# EAGLE design ASD2113 (EAGLE 6.3)
DATABASE: ./../../../../../Components/TinyCircuits_Part_Database.txt
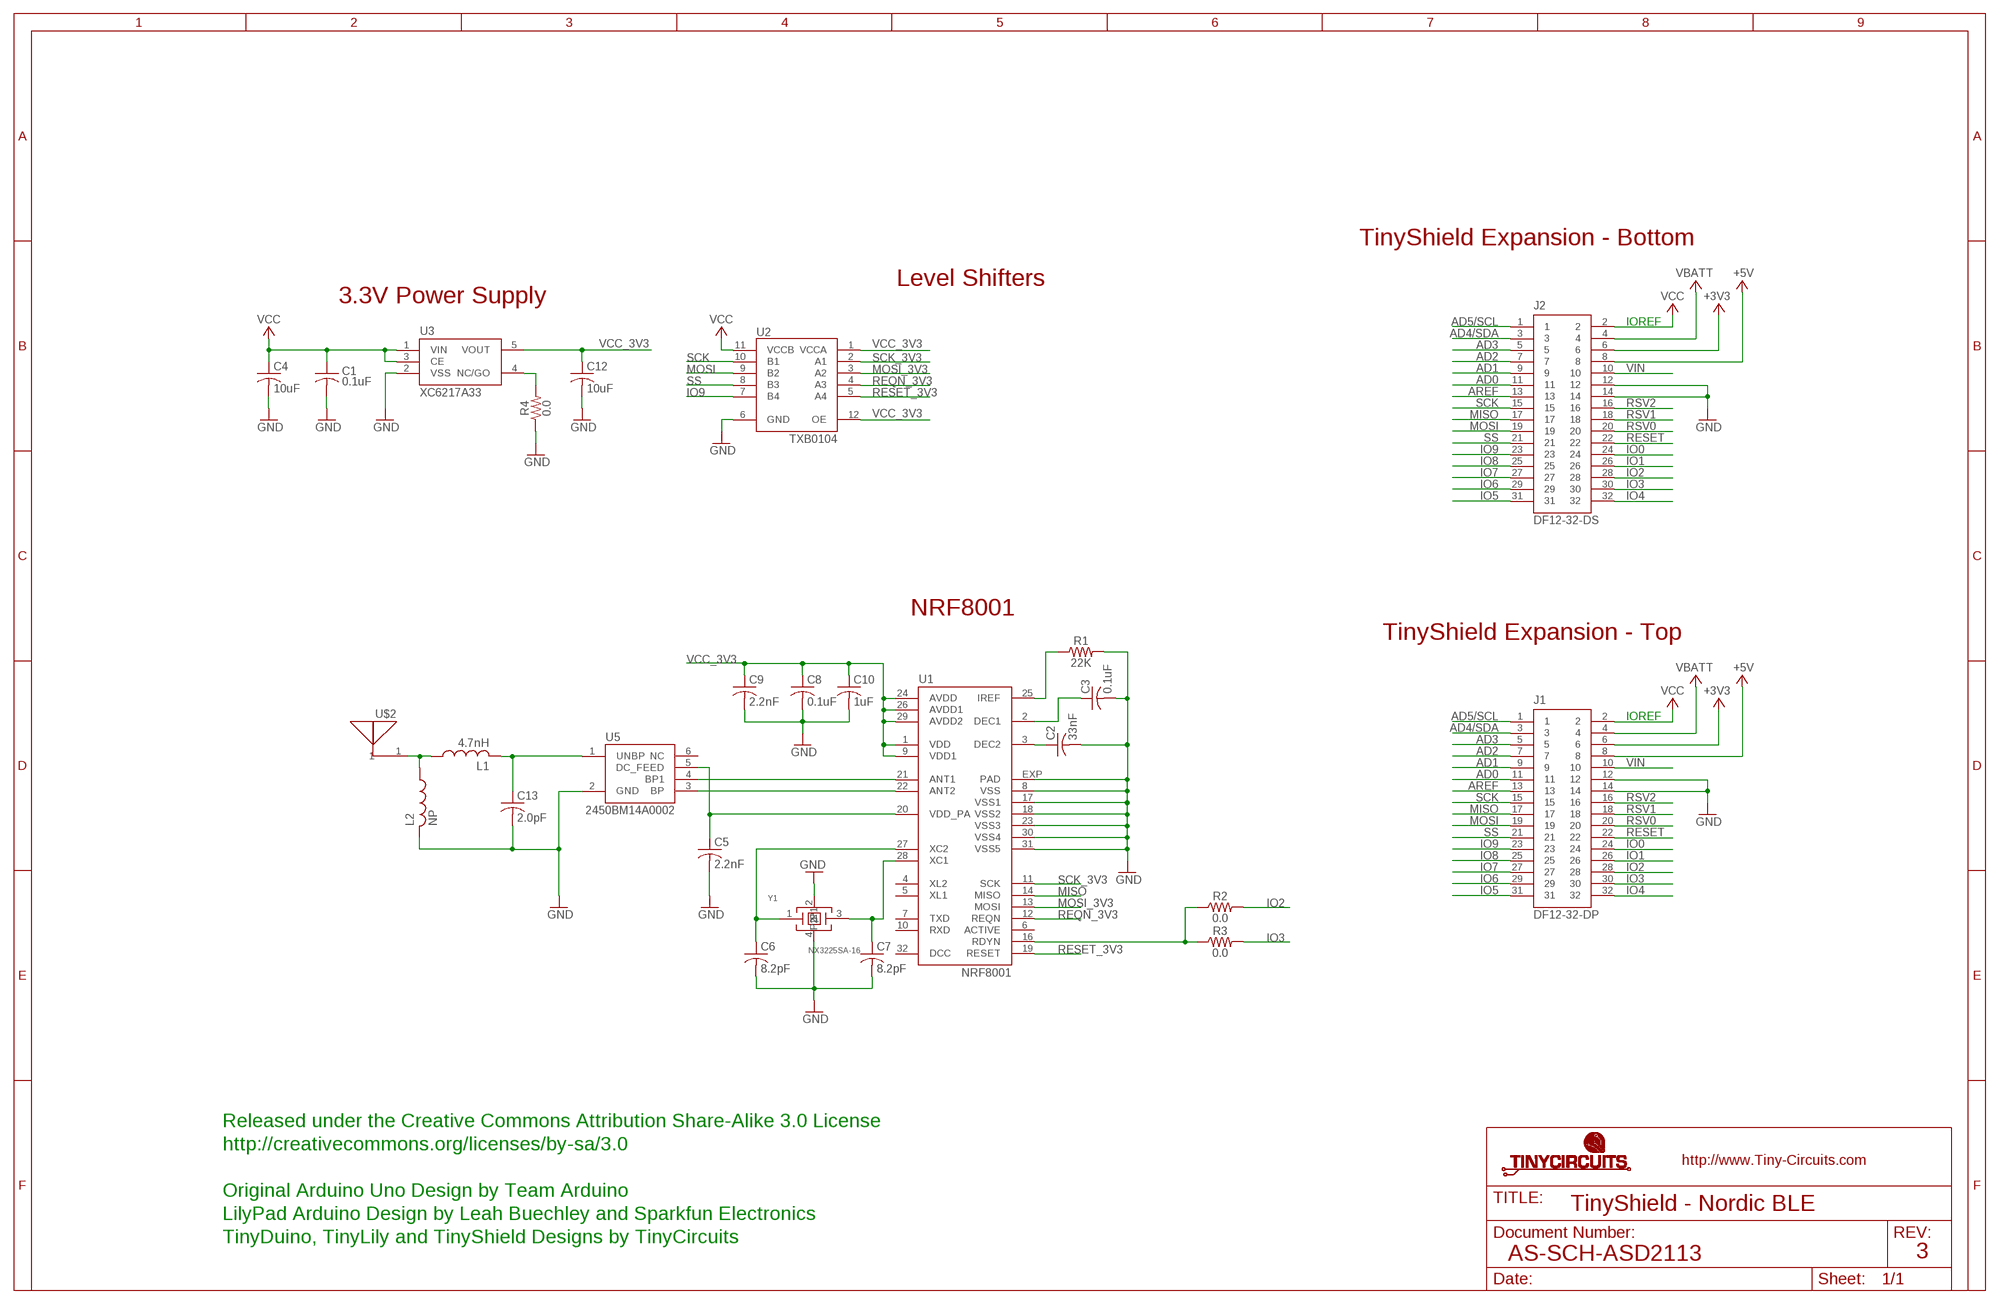
[diagram p0: schematic, sheet 1]

## Parts
C1  0.1uF  AS-ITM-00008  [C0402]
C2  33nF  AS-ITM-00248  [C0402]
C3  0.1uF  AS-ITM-00008  [C0402]
C4  10uF  AS-ITM-00045  [C0805]
C5  2.2nF  AS-ITM-00085  [C0402]
C6  8.2pF  AS-ITM-00247  [C0402]
C7  8.2pF  AS-ITM-00247  [C0402]
C8  0.1uF  AS-ITM-00008  [C0402]
C9  2.2nF  AS-ITM-00085  [C0402]
C10  1uF  AS-ITM-00105  [C0402]
C12  10uF  AS-ITM-00045  [C0805]
C13  2.0pF  AS-ITM-00245  [C0402]
J1  DF12-32-DP  AS-ITM-00015  [DF12-32-DP]
J2  DF12-32-DS  AS-ITM-00012  [DF12-32-DS]
L1  4.7nH  AS-ITM-00246  [C0402]
L2  NP  AS-ITM-00108  [C0402]
R1  22K  AS-ITM-00147  [0402]
R2  0.0  AS-ITM-00076  [0402]
R3  0.0  AS-ITM-00076  [0402]
R4  0.0  AS-ITM-00076  [0402]
U1  NRF8001  AS-ITM-00227  [ATMEL_QFN32]
U2  TXB0104  AS-ITM-00048  [UQFN-12]
U3  XC6217A33  AS-ITM-00249  [SOT-25]
U5  2450BM14A0002  AS-ITM-00114  [2450BM14A0002]
U$2  AS-ITM-00132  [2450AT18A100]
Y1  NX3225SA-16  AS-ITM-00228  [ABM11]

## Nets
+3V3: J1.6 J2.6
+5V: J1.8 J2.8
AD0: J1.11 J2.11
AD1: J1.9 J2.9
AD2: J1.7 J2.7
AD3: J1.5 J2.5
AD4/SDA: J1.3 J2.3
AD5/SCL: J1.1 J2.1
AREF: J1.13 J2.13
GND: C1.2 C2.2 C3.2 C4.2 C5.2 C6.2 C7.2 C8.2 C9.2 C10.2 C12.2 C13.2 J1.12 J1.14 J2.12 J2.14 L2.2 R1.2 R4.1 U1.8(VSS) U1.17(VSS1) U1.18(VSS2) U1.23(VSS3) U1.30(VSS4) U1.31(VSS5) U1.EXP(PAD) U2.6(GND) U3.2(VSS) U5.2(GND) Y1.2 Y1.4(P1)
IO0: J1.24 J2.24
IO1: J1.26 J2.26
IO2: J1.28 J2.28 R2.2
IO3: J1.30 J2.30 R3.2
IO4: J1.32 J2.32
IO5: J1.31 J2.31
IO6: J1.29 J2.29
IO7: J1.27 J2.27
IO8: J1.25 J2.25
IO9: J1.23 J2.23 U2.7(B4)
MISO: J1.17 J2.17 U1.14(MISO)
MOSI: J1.19 J2.19 U2.9(B2)
MOSI_3V3: U1.13(MOSI) U2.3(A2)
N$1: R1.1 U1.25(IREF)
N$2: C6.1 U1.27(XC2) Y1.1
N$3: C13.1 L1.2 U5.1(UNBP)
N$4: C3.1 U1.2(DEC1)
N$5: C2.1 U1.3(DEC2)
N$6: U1.22(ANT2) U5.3(BP)
N$7: U1.21(ANT1) U5.4(BP1)
N$8: C5.1 U1.20(VDD_PA) U5.5(DC_FEED)
N$9: C7.1 U1.28(XC1) Y1.3
N$10: L1.1 L2.1 U$2.1
N$11: R4.2 U3.4(NC/GO)
RDYN: R2.1 R3.1 U1.16(RDYN)
REQN_3V3: U1.12(REQN) U2.4(A3)
RESET: J1.22 J2.22
RESET_3V3: U1.19(RESET) U2.5(A4)
RSV0: J1.20 J2.20
RSV1: J1.18 J2.18
RSV2: J1.16 J2.16
SCK: J1.15 J2.15 U2.10(B1)
SCK_3V3: U1.11(SCK) U2.2(A1)
SS: J1.21 J2.21 U2.8(B3)
VBATT: J1.4 J2.4
VCC: C1.1 C4.1 J1.2 J2.2 U2.11(VCCB) U3.1(VIN) U3.3(CE)
VCC_3V3: C8.1 C9.1 C10.1 C12.1 U1.1(VDD) U1.9(VDD1) U1.24(AVDD) U1.26(AVDD1) U1.29(AVDD2) U2.1(VCCA) U2.12(OE) U3.5(VOUT)
VIN: J1.10 J2.10
Unconnected: U1.4(XL2) U1.5(XL1) U1.6(ACTIVE) U1.7(TXD) U1.10(RXD) U1.32(DCC) U5.6(NC) U$2.2

## Notes on the sheet
- TinyShield Expansion - Bottom
- Level Shifters
- 3.3V Power Supply
- IOREF
- NRF8001
- TinyShield Expansion - Top
- IOREF
- Released under the Creative Commons Attribution Share-Alike 3.0 License
- http://creativecommons.org/licenses/by-sa/3.0
- Original Arduino Uno Design by Team Arduino
- TinyShield - Nordic BLE
- LilyPad Arduino Design by Leah Buechley and Sparkfun Electronics
- TinyDuino, TinyLily and TinyShield Designs by TinyCircuits
- AS-SCH-ASD2113 | 3

## Library data of the parts
C1 C3 C8 = tinycircuits:AS-ITM-00008: CAP CER 0.1UF 16V 10% X5R 0402; PARTNO: AS-ITM-00008
C2 = tinycircuits:AS-ITM-00248: CAP CER 0.033UF 16V Y5V 0402; PARTNO: AS-ITM-00248
C4 C12 = tinycircuits:AS-ITM-00045: CAP CER 16UF 16V 20% X5R 0805; PARTNO: AS-ITM-00045
C5 C9 = tinycircuits:AS-ITM-00085: CAP CER 2.2NF 50V 10% X7R 0402; PARTNO: AS-ITM-00085
C6 C7 = tinycircuits:AS-ITM-00247: CAP CER 8.2PF 50V NP0 0402; PARTNO: AS-ITM-00247
C10 = tinycircuits:AS-ITM-00105: CAP CER 1UF 6.3V 10% X5R 0402; PARTNO: AS-ITM-00105
C13 = tinycircuits:AS-ITM-00245: CAP CER 2PF 50V C0G 0402; PARTNO: AS-ITM-00245
J1 = tinycircuits:AS-ITM-00015: CONN HEADER 32POS 3MM SMD 0.5MM; PARTNO: AS-ITM-00015
J2 = tinycircuits:AS-ITM-00012: CONN RECEPT 32POS 3MM SMD 0.5MM; PARTNO: AS-ITM-00012
L1 = tinycircuits:AS-ITM-00246: FIXED IND 4.7NH 300MA 240 MOHM; PARTNO: AS-ITM-00246
L2 = tinycircuits:AS-ITM-00108: INDUCTOR MULTILAYER 2.2NH 0402; PARTNO: AS-ITM-00108; VALUE: 2.2nH
R1 = tinycircuits:AS-ITM-00147: RES 22K OHM 1/16W 5% 0402 SMD; PARTNO: AS-ITM-00147
R2-R4 = tinycircuits:AS-ITM-00076: RES 0.0 OHM 1/16W 1% 0402 SMD; PARTNO: AS-ITM-00076
U1 = tinycircuits:AS-ITM-00227: RF System on a Chip - SoC BLUETOOTH LW ENERGY SLAVE CONNCTIVTY-CHP; PARTNO: AS-ITM-00227
U2 = tinycircuits:AS-ITM-00048: IC VOLT-LEVEL TRANSLATOR 12UQFN; PARTNO: AS-ITM-00048
U3 = tinycircuits:AS-ITM-00249: IC REG LDO 3.3V 0.2A SOT25; PARTNO: AS-ITM-00249
U5 = tinycircuits:AS-ITM-00114: 2.45 GHz Impredance Matched Balun-Filter; PARTNO: AS-ITM-00114
U$2 = tinycircuits:AS-ITM-00132: ANTENNA CHIP 2.4GHZ; PARTNO: AS-ITM-00132; VALUE: 2450AT18A100
Y1 = tinycircuits:AS-ITM-00228: CRYSTAL 16MHZ 8PF SMD; PARTNO: AS-ITM-00228; VALUE: 8Y-16.000MAAV-T

## Board
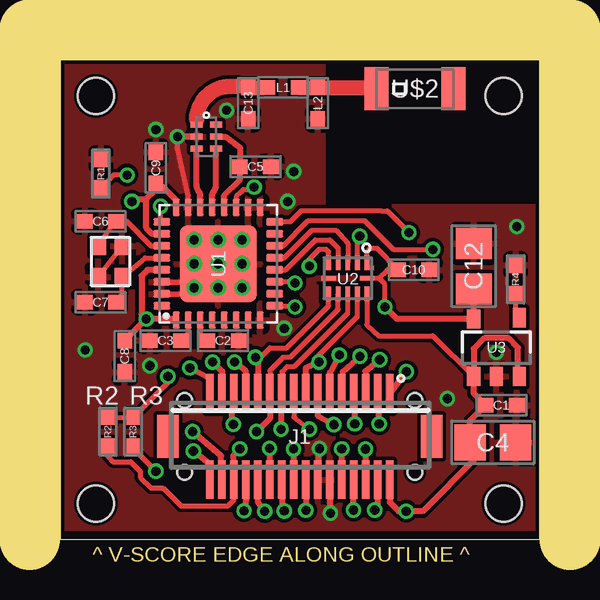
[diagram p1: board, top side]
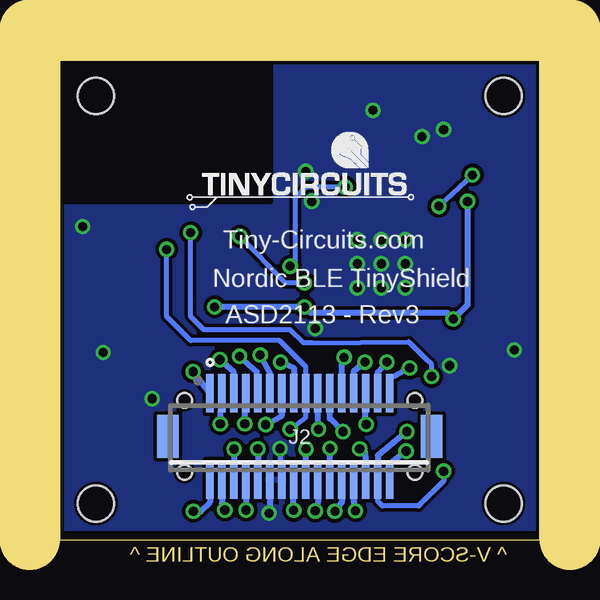
[diagram p2: board, bottom side, seen from below]

Size 20 x 20 mm. Coordinates in mm from the lower left corner, seen from the top.
Outline: 20,0 0,0 0,20 20,20 20,0
Copper layers (1*16): Top 0.035mm / dielectric 1.5mm / Bottom 0.035mm
Design rules "default *": minimum track width 7mil, minimum drill 15mil, track to track 6mil, track to pad 6mil, pad to pad 6mil, via to via 6mil, smd to smd 6mil, copper to edge 6mil, drill to drill 8mil, minimum pad ring 10mil, minimum via ring 5mil, stop-mask expansion 4mil, vias tented up to drill 25mil, thermal gap 10mil
Holes 1.5 mm at 1.5,18.5 18.5,18.5 18.5,1.5 1.5,1.5
tRestrict: 3 lines
bRestrict: 3 lines
Milling: 3 lines

### Footprints (pad centres in the part's own frame; a part is rotated, then mirrored left to right if it is on the bottom)
C0402 = smd 0.65 x 0.6: 1 -0.65,0; 2 0.65,0
C0805 = smd 1.3 x 1.5: 1 -0.95,0; 2 0.95,0
DF12-32-DP = smd 0.3 x 1.6: 1 -3.75,-1.8; 2 -3.75,1.8; 3 -3.25,-1.8; 4 -3.25,1.8; 5 -2.75,-1.8; 6 -2.75,1.8; 7 -2.25,-1.8; 8 -2.25,1.8; 9 -1.75,-1.8; 10 -1.75,1.8; 11 -1.25,-1.8; 12 -1.25,1.8; 13 -0.75,-1.8; 14 -0.75,1.8; 15 -0.25,-1.8; 16 -0.25,1.8; 17 0.25,-1.8; 18 0.25,1.8; 19 0.75,-1.8; 20 0.75,1.8; 21 1.25,-1.8; 22 1.25,1.8; 23 1.75,-1.8; 24 1.75,1.8; 25 2.25,-1.8; 26 2.25,1.8; 27 2.75,-1.8; 28 2.75,1.8; 29 3.25,-1.8; 30 3.25,1.8; 31 3.75,-1.8; 32 3.75,1.8 | smd 0.9 x 1.8: F1 -5.5,0; F2 5.5,0 | hole 0.6: -4.8,1.5; 4.8,1.5
DF12-32-DS = smd 0.3 x 1.6: 1 -3.75,1.8; 2 -3.75,-1.8; 3 -3.25,1.8; 4 -3.25,-1.8; 5 -2.75,1.8; 6 -2.75,-1.8; 7 -2.25,1.8; 8 -2.25,-1.8; 9 -1.75,1.8; 10 -1.75,-1.8; 11 -1.25,1.8; 12 -1.25,-1.8; 13 -0.75,1.8; 14 -0.75,-1.8; 15 -0.25,1.8; 16 -0.25,-1.8; 17 0.25,1.8; 18 0.25,-1.8; 19 0.75,1.8; 20 0.75,-1.8; 21 1.25,1.8; 22 1.25,-1.8; 23 1.75,1.8; 24 1.75,-1.8; 25 2.25,1.8; 26 2.25,-1.8; 27 2.75,1.8; 28 2.75,-1.8; 29 3.25,1.8; 30 3.25,-1.8; 31 3.75,1.8; 32 3.75,-1.8 | smd 0.9 x 1.8: F1 -5.5,0; F2 5.5,0 | hole 0.6: -4.8,1.5; 4.8,1.5
0402 = smd 0.65 x 0.55: 1 -0.6,0; 2 0.6,0
ATMEL_QFN32 = smd 0.711 x 0.305: 1 -2.351,1.75; 2 -2.351,1.25; 3 -2.351,0.75; 4 -2.351,0.25; 5 -2.351,-0.25; 6 -2.351,-0.75; 7 -2.351,-1.25; 8 -2.351,-1.75; 17 2.351,-1.75; 18 2.351,-1.25; 19 2.351,-0.75; 20 2.351,-0.25; 21 2.351,0.25; 22 2.351,0.75; 23 2.351,1.25; 24 2.351,1.75 | smd 0.305 x 0.711: 9 -1.75,-2.351; 10 -1.25,-2.351; 11 -0.75,-2.351; 12 -0.25,-2.351; 13 0.25,-2.351; 14 0.75,-2.351; 15 1.25,-2.351; 16 1.75,-2.351; 25 1.75,2.351; 26 1.25,2.351; 27 0.75,2.351; 28 0.25,2.351; 29 -0.25,2.351; 30 -0.75,2.351; 31 -1.25,2.351; 32 -1.75,2.351 | smd 3.2 x 3.2: EXP 0,0
UQFN-12 = smd 0.2 x 0.6: 1 -0.8,-0.65; 2 -0.4,-0.65; 3 0,-0.65; 4 0.4,-0.65; 5 0.8,-0.65; 7 0.8,0.65; 8 0.4,0.65; 9 0,0.65; 10 -0.4,0.65; 11 -0.8,0.65 | smd 0.6 x 0.2: 6 0.8,0; 12 -0.8,0
SOT-25 = smd 0.55 x 0.8: 1 -0.95,-1.2; 2 0,-1.2; 3 0.95,-1.2; 4 0.95,1.25; 5 -0.95,1.2
2450BM14A0002 = smd 0.25 x 0.5: 1 0.5,0.4; 2 0,0.4; 3 -0.5,0.4; 4 -0.5,-0.4; 5 0,-0.4; 6 0.5,-0.4
2450AT18A100 = smd 1 x 1.8: 1 1.6,0; 2 -1.6,0
ABM11 = smd 0.75 x 0.65: 1 -0.65,-0.5; 2 0.65,-0.5; 3 0.65,0.5; 4 -0.65,0.5

### Placement (x,y rotation side)
C1  18.4,5.6 0 top
C2  6.8,8.3 0 top
C3  4.4,8.3 180 top
C4  18.05,4.05 0 top
C5  8.15,15.55 0 top
C6  1.69,13.27 180 top
C7  1.69,9.9 180 top
C8  2.7,7.65 270 top
C9  4,15.5 90 top
C10  14.75,11.25 0 top
C12  17.25,11.4 90 top
C13  7.85,18.2 270 top
J1  10,4.3 180 top
J2  10,4.3 0 bottom
L1  9.3,18.85 180 top
L2  10.75,18.2 270 top
R1  1.71,15.26 90 top
R2  2,4.5 270 top
R3  3.05,4.5 270 top
R4  19,10.85 270 top
U1  6.6,11.5 90 top
U2  12,10.9 180 top
U3  18.2,8 0 top
U5  6.1,16.8 90 top
U$1  [DOCFIELD-TINYCIRCUITS-PCB]  33.91,-10 0 top  (outside the outline)
U$2  14.8,18.8 180 top
Y1  2.1,11.6 270 top

### Tracks (layer width: path | path; a pad name or v marks a point on that pad's centre or on a via)
+3V3  (via drill 0.38)
  Top 0.254: J2.6 v12.75,3.77 v12.74,3.77
  Bottom 0.254: v12.74,3.77 12.74,2.51 J2.6
+5V  (via drill 0.38)
  Top 0.254: v12.24,1.23 J2.8
  Bottom 0.254: J2.8 12.25,1.21 v12.24,1.23
AD0  (via drill 0.38)
  Top 0.254: v11.65,7.7 11.25,6.95 J2.11
  Bottom 0.254: J2.11 11.25,6.95 v11.65,7.7
AD1  (via drill 0.38)
  Top 0.254: J2.9 11.79,7 v12.51,7.64
  Bottom 0.254: v12.51,7.64 11.78,7 J2.9
AD2  (via drill 0.38)
  Top 0.254: v12.29,4.83 12.31,5.05 J2.7
  Bottom 0.254: J2.7 12.27,5.86 v12.29,4.83
AD3  (via drill 0.38)
  Top 0.254: v13.33,7.5 12.73,7.02 J2.5
  Bottom 0.254: J2.5 12.75,6.98 v13.33,7.5
AD4/SDA  (via drill 0.38)
  Top 0.254: v13.31,4.83 13.31,5 J2.3
  Bottom 0.254: J2.3 13.28,5.86 v13.31,4.83
AD5/SCL  (via drill 0.38)
  Top 0.254: v14.45,7 J2.1
  Bottom 0.254: J2.1 v14.45,7
AREF  (via drill 0.38)
  Top 0.254: J2.13 10.77,5.14 v11.42,4.79
  Bottom 0.254: v11.42,4.79 10.77,5.14 J2.13
GND  (via drill 0.38)
  Top 0.2: U1.30 5.85,10.75 U1.EXP | U1.31 5.45,10.25 6.6,11.4
  Top 0.203: v11.29,1.1 11.25,1.13 J1.12 11.29,2.46 | Y1.2 Y1.4 | U1.23 5.35,14.35 4.9,16.3 v4.9,16.8 | v10.83,3.79 10.75,3.54 J1.14 v10.83,3.79
  Top 0.254: v11.29,1.1 11.29,2.46 | U5.2 v4.9,16.8
  Bottom 0.203: J1.14 v10.83,3.79 | 11.25,1.13 v11.29,1.1
  Bottom 0.254: J1.12 11.25,1.13
  other vias: 16.16,5.88 9.35,8.81 1.05,7.91 3.75,7.25 6.6,11.5 5.6,11.5 7.6,11.5 7.6,12.5 6.6,12.5 5.6,12.5 5.6,10.5 6.6,10.5 7.6,10.5 18.2,7.8 9.5,14.1 9.75,15.35 4,17.1 6.95,17.9 19.05,13.05
  pour Top: 0,20 20,20 20,0 0,0
  pour Bottom: 0,20 20,20 20,0 0,0
IO0  (via drill 0.38)
  Top 0.254: v8.54,1.18 8.25,1.56 J2.24
  Bottom 0.254: J2.24 8.25,1.56 v8.54,1.18
IO1  (via drill 0.38)
  Top 0.254: J2.26 7.75,1.63 v7.67,1.2
  Bottom 0.203: 7.73,2.48 J2.26
  Bottom 0.254: v7.67,1.2 7.73,1.61 7.73,2.48
IO2  (via drill 0.38)
  Top 0.203: R2.2 2,3.45 2.2,3.25 2.95,3.25 3.35,2.85 3.35,2.6 3.8,2.15 4.3,2.15 5.05,1.4 7,1.4 7.25,1.65 J2.28
  Top 0.254: v7.5,3.78 7.33,3.66 7.22,3.49 7.29,2.61 7.26,2.51 J2.28
  Bottom 0.254: J2.28 7.24,3.43 7.28,3.65 v7.5,3.78
IO3  (via drill 0.38)
  Top 0.203: R3.2 3.05,3.8 v4,2.85
  Top 0.254: J2.30 6.73,3.49 v5.53,4.5
  Bottom 0.203: v4,2.85 4,2.45 5.05,1.4 6.55,1.4 6.75,1.6 J2.30
  Bottom 0.254: v5.53,4.5 6.75,3.51 6.77,2.53 J2.30
IO4  (via drill 0.38)
  Top 0.254: J2.32 6.25,3.14 v5.56,3.69
  Bottom 0.254: v5.56,3.69 5.61,3.65 6.21,3.18 6.21,3.14 6.26,3.1 J2.32
IO5  (via drill 0.38)
  Top 0.254: v5.42,7.16 6.23,6.73 J2.31
  Bottom 0.254: J2.31 6.26,6.69 v5.42,7.16
IO6  (via drill 0.38)
  Top 0.254: J2.29 6.76,7.01 v6.36,7.4
  Bottom 0.254: J2.29 6.75,6.98 v6.36,7.4
IO7  (via drill 0.38)
  Top 0.254: v7.23,4.8 7.16,4.95 J2.27
  Bottom 0.254: J2.27 7.29,5.76 v7.23,4.8
IO8  (via drill 0.38)
  Top 0.203: 7.78,6.13 J2.25
  Top 0.254: J2.25 7.75,7.02 v7.28,7.4
  Bottom 0.254: J2.25 7.75,7.02 v7.28,7.4
IO9  (via drill 0.38)
  Top 0.203: 8.25,7.5 8.75,8 9.45,8 11.2,9.75 U2.7
  Top 0.254: v8.15,7.6 8.25,7.5 J2.23
  Bottom 0.254: J2.23 8.25,7.5 v8.15,7.6
MISO  (via drill 0.38)
  Top 0.203: 9.74,6.11 J2.17 9.75,5.1 v10.4,4.6 | U1.14 9.3,12.25 10.35,13.3 12.7,13.3 13.9,12.1 v15.55,12.1
  Bottom 0.203: v10.4,4.6 9.75,5.1 J2.17 9.75,7.2 10.85,8.3 14.55,8.3 15.55,9.3 v15.55,12.1
MOSI  (via drill 0.38)
  Top 0.203: J2.19 9.25,7 9.45,7.2 9.75,7.2 12,9.45 U2.9
  Top 0.254: v9.22,4.6 9.23,5.26 J2.19
  Bottom 0.254: J2.19 9.25,5.26 v9.22,4.6
MOSI_3V3
  Top 0.203: U1.13 9.35,11.75 10.5,12.9 11.5,12.9 12,12.35 U2.3
N$1  (via drill 0.38)
  Top 0.2: R1.1 2.21,15.19 v2.8,15.2 | U1.25 4.2,13.3 v4.2,13.9
  Bottom 0.2: v4.2,13.9 v2.8,15.2
N$2
  Top 0.2: Y1.1 2.3,13.3 | 2.3,13.3 2.75,13.3 3.8,12.25 U1.27 | C6.1 2.3,13.27 2.3,13.3
N$3
  Top 0.2: 7.4,18.9 7.85,19 arc90 C13.1 | 8.5,18.85 arc90 L1.2
  Top 0.254: U5.1 5.7,17.5
  Top 0.635: 5.7,17.5 arc-90 7.1,18.9 7.4,18.9 | C13.1 8.5,18.85
N$4
  Top 0.2: U1.2 5.35,8.6 C3.1
N$5
  Top 0.2: U1.3 5.85,8.6 C2.1
N$6
  Top 0.254: U1.22 5.85,14.35 arc45 5.8,14.5 arc-45 5.7,14.8 U5.3
N$7
  Top 0.254: U1.21 6.35,14.35 arc-45 6.4,14.5 arc45 6.5,14.8 U5.4
N$8
  Top 0.2: 7.5,15.35 C5.1
  Top 0.254: U1.20 6.85,14.35 7.5,15 C5.1 7.5,16.35 6.9,16.8 U5.5
N$9
  Top 0.2: U1.28 3.55,11.75 Y1.3 2.6,10.26 C7.1
N$10
  Top 0.2: 10.95,18.85 arc-90 L2.1 | 12.95,18.85 arc-90 U$2.1
  Top 0.635: L1.1 L2.1 10.95,18.85 12.95,18.85
N$11
  Top 0.203: U3.4 19,9.25 R4.2
RDYN  (via drill 0.38)
  Top 0.2: 13.4,13.7 10.05,13.7 9.6,13.25 U1.16
  Top 0.203: 13.4,13.7 13.65,13.7 v14.55,12.8 | R2.1 R3.1 4.5,6.55 v4.5,6.8
  Bottom 0.2: 9.5,8.2 5.45,8.25 4.7,7.5
  Bottom 0.203: v14.55,12.8 14.55,9.3 14,8.75 10.4,8.75 9.85,8.2 9.5,8.2 | v4.5,6.8 4.5,7.3 4.7,7.5
REQN_3V3
  Top 0.203: U1.12 9.4,11.25 10.65,12.5 11.25,12.5 11.6,12.15 U2.4
RESET  (via drill 0.38)
  Top 0.254: v8.74,3.8 J2.22
  Bottom 0.254: J2.22 8.75,3.69 v8.74,3.8
RESET_3V3  (via drill 0.38)
  Top 0.2: 7.55,14.5 7.35,14.3 U1.19
  Top 0.203: U2.5 11.2,12 11.1,12.1 10.8,12.1 10.4,11.7 v10.4,11.4 | 7.55,14.5 7.65,14.6 7.95,14.6 v8.1,14.7
  Bottom 0.203: v8.1,14.7 9.75,14.7 10.2,14.25 10.2,11.6 v10.4,11.4
RSV0  (via drill 0.38)
  Top 0.254: J2.20 9.25,1.2 v9.36,1.19
  Bottom 0.254: J2.20 9.25,1.84 9.25,1.2 v9.36,1.19
RSV1  (via drill 0.38)
  Top 0.254: v9.74,3.77 9.74,2.51 J2.18
  Bottom 0.254: J2.18 9.75,3.72 v9.74,3.77
RSV2  (via drill 0.38)
  Top 0.254: J2.16 10.25,1.16 v10.25,1.22
  Bottom 0.254: v10.25,1.22 J2.16
SCK  (via drill 0.38)
  Top 0.203: U2.10 12.4,9.3 10.8,7.7 v10.8,7.4
  Top 0.254: J2.15 10.25,7.15 v10.8,7.4
  Bottom 0.254: v10.8,7.4 10.25,7.15 J2.15
SCK_3V3  (via drill 0.38)
  Top 0.2: U2.2 12.4,12.55 v12.5,12.65 | v9.8,10.7 9.75,10.75 U1.11
  Bottom 0.203: v9.8,10.7 10.6,10.7 v12.5,12.65
SS  (via drill 0.38)
  Top 0.203: J2.21 8.75,7.05 9.3,7.6 9.6,7.6 11.6,9.6 U2.8
  Top 0.254: J2.21 8.75,5.05 v8.2,4.5
  Bottom 0.254: v8.2,4.5 8.75,5.05 J2.21
VBATT  (via drill 0.38)
  Top 0.254: v13.13,1.23 13.25,1.48 J2.4
  Bottom 0.254: J2.4 13.25,1.5 v13.13,1.23
VCC  (via drill 0.38)
  Top 0.2: U2.11 12.8,8.95 13.3,8.5 15.55,8.5 | 17.05,7.15 U3.1 | v14.44,1.18 14.47,1.15 | U3.3 19.1,6.85
  Top 0.203: 15.55,8.5 U3.1
  Top 0.254: J2.2 13.75,1.56 14.13,1.18 14.38,1.18 v14.44,1.18 15.13,1.18 17.35,3.4 C4.1 17.1,4.95 C1.1 17.25,6.1 U3.1 17.25,7.95 17.7,8.4 18.7,8.4 19.1,8 19.1,6.85
  Bottom 0.254: v14.44,1.18 14.38,1.18 14.13,1.18 13.75,1.56 J2.2
VCC_3V3  (via drill 0.38)
  Top 0.2: U1.9 9.65,9.75 v9.8,9.7 | 12.8,12 12.95,12.15 13.2,12.15 | 4.8,9.2 U1.1 | C9.1 4,14.6
  Top 0.203: U2.1 12.8,12 | v13.55,9.7 13.55,10.65 13.3,10.9 | 13.2,12.15 C10.1 13.65,11.25 13.3,10.9 | U2.12 13.3,10.9
  Top 0.254: U1.29 3.65,11.25 3.4,11 3.4,9.4 v3.6,9.2 | U1.26 3.85,12.75 3.6,13 3.6,14.2 | 3.6,14.2 4,14.6 | U1.24 4.85,14.15 4.3,14.7 C9.1 | v3,14.1 3.1,14.2 3.6,14.2 | 4.8,9.2 v3.6,9.2 | C8.1 v3.6,9.2 | v13.55,9.7 14.05,9.2 U3.5 C12.1
  Bottom 0.254: v3,14.1 3,9.8 v3.6,9.2 3.85,9.45 9.55,9.45 v9.8,9.7 v13.55,9.7
VIN  (via drill 0.38)
  Top 0.254: J2.10 v11.76,3.78 v11.75,3.78
  Bottom 0.254: v11.75,3.78 J2.10

### Text on the board
Dimension: ^ V-SCORE EDGE ALONG OUTLINE ^
tPlace: R2 | R3
bPlace: Tiny-Circuits.com | Nordic BLE TinyShield | ASD2113 - Rev3
Document: FABRICATION DRAWING | NOTES: | 1. PRINTED CIRCUIT BOARD MADE FROM NEMA GRADE FR-4 EPOXY LAMINATE | WITH 1 OUNCE COPPER PLATING AND .024 THICKNESS. | 2. ALL DIMENSIONS ARE GIVEN IN INCHES. | 3. CIRCUIT PATHS ARE FOR REFERENCE ONLY. | 4. HOLE SIZES SHOWN ARE FINISHED DIAMETERS AFTER PLATING. | 5. BOARD PLATED USING REFLOW OR SIMILAR METHOD. | 6. BOARD TO HAVE BLUE SOLDER MASK ON PLATED SURFACES USING WET FILM | 7. SILKSCREEN BOARD USING WHITE INK. | SR100 OR SR1010 EPOXY. EQUIVALENT WET OR DRY FILM MAY BE USED. | 8. THE FOLLOWING INFORMATION APPLIES TO THIS BOARD: | * 2 COPPER LAYERS | * .024 BOARD THICKNESS | * REQUIRES TOP SIDE SILKSCREEN | Released under the Creative Commons Attribution Share-Alike 3.0 License | http://creativecommons.org/licenses/by-sa/3.0 | Original Arduino Uno Design by Team Arduino | LilyPad Arduino Design by Leah Buechley and Sparkfun Electronics | TinyDuino, TinyLily and TinyShield Designs by TinyCircuits | TinyShield - Nordic BLE | AS-PCB-ASD2113 | 3